# Altium schematic sheet Capteur_Therm.SchDoc
size A3; Organization: ETML-ES; Address1: Avenue Recordon 1; Address2: 1004 Lausanne; Address3: Switzerland; SheetNumber: 1; SheetTotal: 1
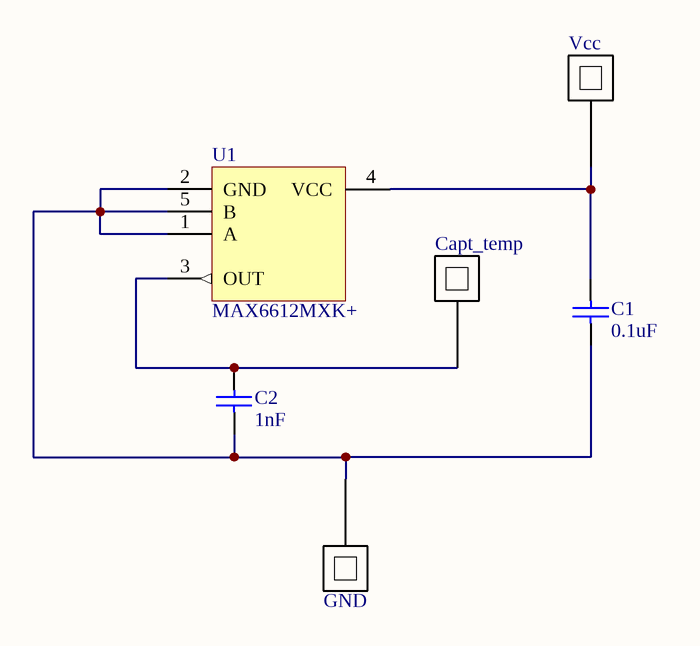
[diagram p0: Capteur_Therm.SchDoc]

## Parts
C1  value 0.1uF  [C0805]  (hidden comment: Cap)
C2  value 1nF  [C0805]  (hidden comment: Cap)
Capt_temp  Capt_temp  [PIN1]  (value not drawn)
GND  GND  [PIN1]  (value not drawn)
U1  MAX6612MXK+  [MAXM-X5+1_M]
Vcc  3V3  [PIN1]  (value not drawn)

## Nets
NetC1_1: C1.1 U1.4(VCC) Vcc.1
NetC1_2: C1.2 C2.2 GND.1 U1.1(A) U1.2(GND) U1.5(B)
NetC2_1: C2.1 Capt_temp.1 U1.3(OUT)

## Notes on the sheet
- Fichier :
- a
- Date :
- Heure :
- Version :
- Auteur :
- Modif.
- b
- c
- d
- Projet :
- No :
- Nb feuilles
- Feuille n°
- Chemin :

## Library data of the parts
C1 = Cap: Cap 100nF; Published: 8-Jun-2000; LatestRevisionDate: 17-Jul-2002; LatestRevisionNote: Re-released for DXP Platform.; PackageReference: RAD-0.3; Publisher: Altium Limited; PackageDescription: Radial Cap, Thru-Hole; 2 Leads; 0.3 in Pin Spacing
C2 = Cap: Cap 1nF; Published: 8-Jun-2000; LatestRevisionDate: 17-Jul-2002; LatestRevisionNote: Re-released for DXP Platform.; PackageReference: RAD-0.3; Publisher: Altium Limited; PackageDescription: Radial Cap, Thru-Hole; 2 Leads; 0.3 in Pin Spacing
Capt_temp GND Vcc = Berg: CONN HEADER VERT 1POS; Supplier: Stock ES
U1 = CMP-0253-01154-1: High-Slope, Low-Power, Analog Temperature Sensor, -55 to 150 degC, 5-Pin SOT23 (X5+1), Pb-Free; Parasite Pwr.: No; Mounting Technology: Surface Mount; ComponentLink1Description: Manufacturer URL; ComponentLink2URL: http://datasheets.maximintegrated.com/en/ds/MAX6612-MAX6612MXK.pdf; PackageDescription: 5-Pin SC70 Transistor Package (X5+1), Body 2 x 1.25 mm, Pitch 0.65 mm; Generic Part Number: MAX6612; PackageVersion: Rev. F, 06/2011; ComponentLink1URL: http://www.maximintegrated.com/; DatasheetVersion: Rev. 0; PartNumber: MAX6612MXK+; ComponentLink2Description: Datasheet; PackageReference: X5+1; Code_JEDEC: MO-203; ComponentLink3URL: http://pdfserv.maximintegrated.com/package_dwgs/21-0076.PDF; Interface: Analog; ComponentLink3Description: Package Specification